# EAGLE design drive_subsystem (EAGLE 6.4)
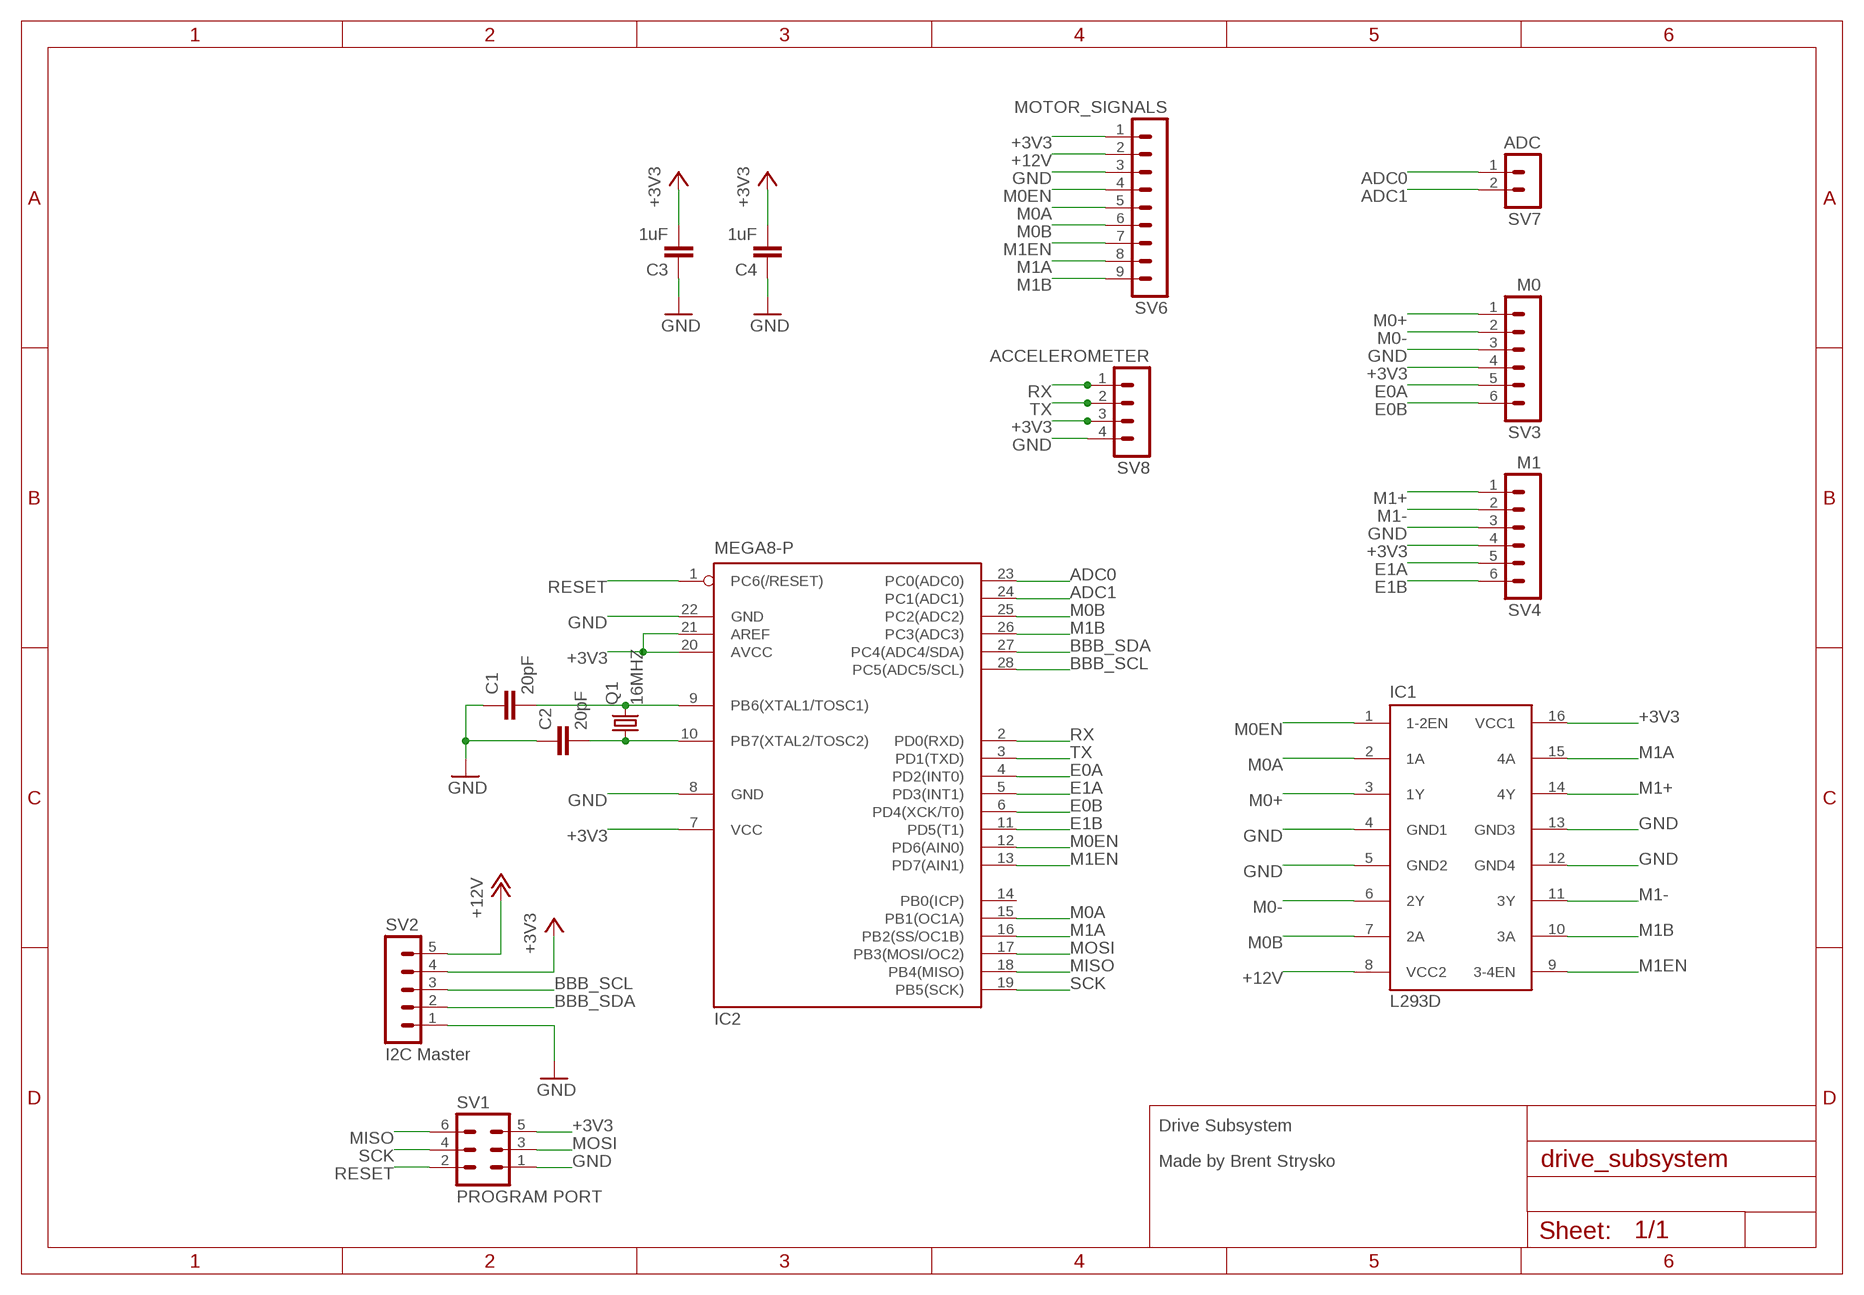
[diagram p0: schematic, sheet 1]

## Parts
C1  20pF  CAPKIT  [CAP-PTH-SMALL-KIT]
C2  20pF  CAPKIT  [CAP-PTH-SMALL-KIT]
C3  1uF  CAPKIT  [CAP-PTH-SMALL-KIT]
C4  1uF  CAPKIT  [CAP-PTH-SMALL-KIT]
IC1  L293D  [DIL16]
IC2  MEGA8-P  [DIL28-3]
Q1  16MHZ  CRYSTALHC49U-V  [HC49U-V]
SV1  PROGRAM PORT  MA03-2  [MA03-2]
SV2  I2C Master  MA05-1  [MA05-1]
SV3  M0  MA06-1  [MA06-1]
SV4  M1  MA06-1  [MA06-1]
SV6  MOTOR_SIGNALS  MA09-1  [MA09-1]
SV7  ADC  MA02-1  [MA02-1]
SV8  ACCELEROMETER  MA04-1  [MA04-1]

## Nets
+3V3: C3.2 C4.2 IC1.16(VCC1) IC2.7(VCC) IC2.20(AVCC) IC2.21(AREF) SV1.5 SV2.4 SV3.4 SV4.4 SV6.1 SV8.3
+12V: IC1.8(VCC2) SV2.5 SV6.2
ADC0: IC2.23(PC0(ADC0)) SV7.1
ADC1: IC2.24(PC1(ADC1)) SV7.2
BBB_SCL: IC2.28(PC5(ADC5/SCL)) SV2.3
BBB_SDA: IC2.27(PC4(ADC4/SDA)) SV2.2
E0A: IC2.4(PD2(INT0)) SV3.5
E0B: IC2.6(PD4(XCK/T0)) SV3.6
E1A: IC2.5(PD3(INT1)) SV4.5
E1B: IC2.11(PD5(T1)) SV4.6
GND: C1.1 C2.1 C3.1 C4.1 IC1.4(GND1) IC1.5(GND2) IC1.12(GND4) IC1.13(GND3) IC2.8(GND) IC2.22(GND) SV1.1 SV2.1 SV3.3 SV4.3 SV6.3 SV8.4
M0+: IC1.3(1Y) SV3.1
M0-: IC1.6(2Y) SV3.2
M0A: IC1.2(1A) IC2.15(PB1(OC1A)) SV6.5
M0B: IC1.7(2A) IC2.25(PC2(ADC2)) SV6.6
M0EN: IC1.1(1-2EN) IC2.12(PD6(AIN0)) SV6.4
M1+: IC1.14(4Y) SV4.1
M1-: IC1.11(3Y) SV4.2
M1A: IC1.15(4A) IC2.16(PB2(SS/OC1B)) SV6.8
M1B: IC1.10(3A) IC2.26(PC3(ADC3)) SV6.9
M1EN: IC1.9(3-4EN) IC2.13(PD7(AIN1)) SV6.7
MISO: IC2.18(PB4(MISO)) SV1.6
MOSI: IC2.17(PB3(MOSI/OC2)) SV1.3
RESET: IC2.1(PC6(/RESET)) SV1.2
RX: IC2.2(PD0(RXD)) SV8.1
SCK: IC2.19(PB5(SCK)) SV1.4
TX: IC2.3(PD1(TXD)) SV8.2
XTAL1: C1.2 IC2.9(PB6(XTAL1/TOSC1)) Q1.2
XTAL2: C2.2 IC2.10(PB7(XTAL2/TOSC2)) Q1.1
Unconnected: IC2.14(PB0(ICP))

## Notes on the sheet
- Drive Subsystem
- Made by Brent Strysko

## Library data of the parts
C1-C4 = SparkFun-Capacitors:CAP: Capacitor Standard 0603 ceramic capacitor, and 0.1" leaded capacitor.
IC1 = st-microelectronics:L293D: PUSH-PULL 4 CHANNEL DRIVER; MPN: L293D; OC_FARNELL: 9589619; OC_NEWARK: 56P8249
IC2 = atmel:MEGA8-P: MICROCONTROLLER 8 Kbytes FLASH, 1 kbytes SRAM, 512 bytes EEPROM, USART, 4-channel 10 bit ADC, 2-channel 8 bit ADC Pin compatible with Atmega48, ATMega88, ATMega168 Source: avr.lbr; OC_FARNELL: unknown; OC_NEWARK: unknown
Q1 = crystal:CRYSTAL: CRYSTAL; OC_FARNELL: 1666969; OC_NEWARK: unknown
SV1 = con-lstb:MA03-2: PIN HEADER; OC_FARNELL: unknown; OC_NEWARK: unknown
SV2 = con-lstb:MA05-1: PIN HEADER; OC_FARNELL: unknown; OC_NEWARK: unknown
SV3 SV4 = con-lstb:MA06-1: PIN HEADER; OC_FARNELL: unknown; OC_NEWARK: unknown
SV6 = con-lstb:MA09-1: PIN HEADER; OC_FARNELL: unknown; OC_NEWARK: unknown
SV7 = hypertriangle:MA02-1: PIN HEADER
SV8 = con-lstb:MA04-1: PIN HEADER; OC_FARNELL: unknown; OC_NEWARK: unknown

## Board
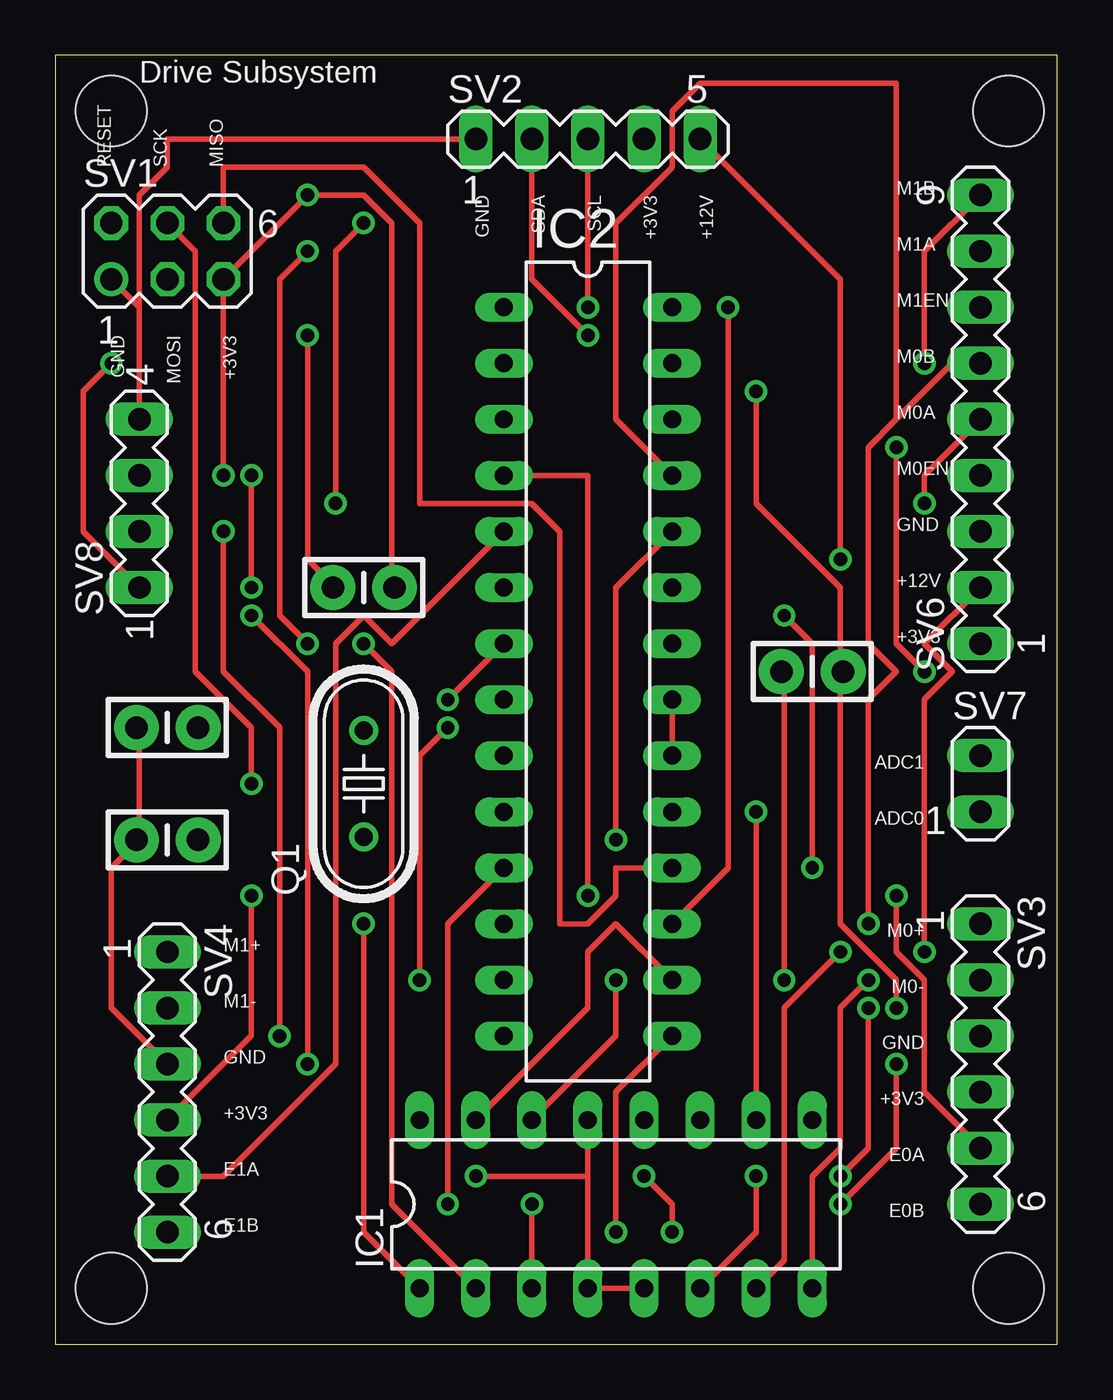
[diagram p1: board, top side]
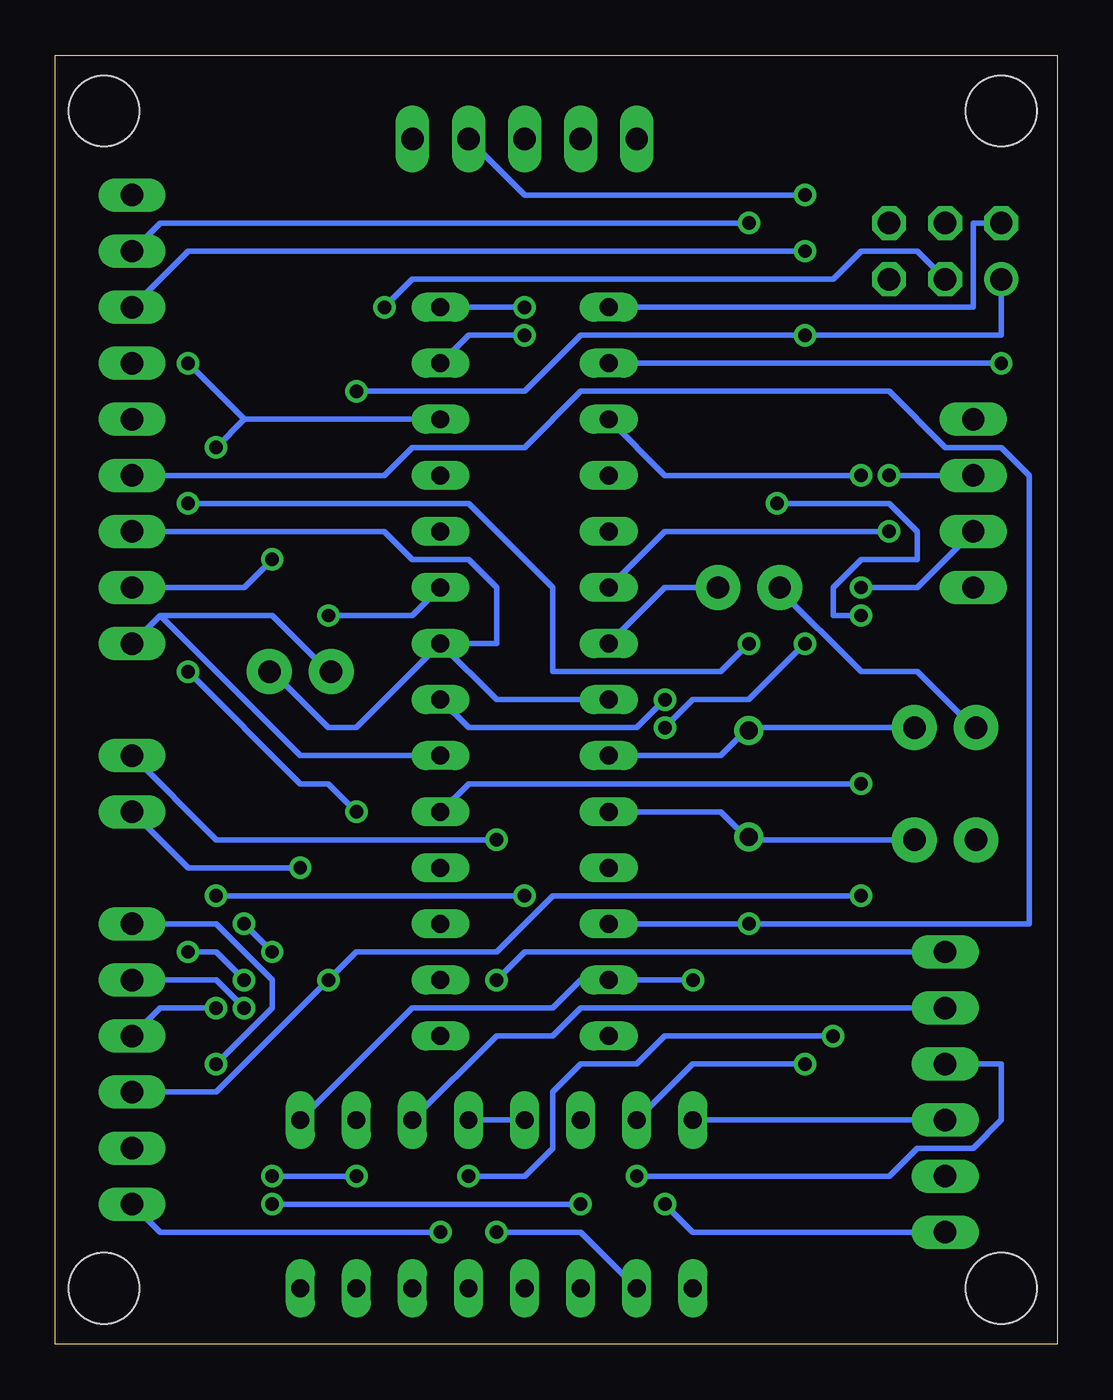
[diagram p2: board, bottom side, seen from below]

Size 45.39 x 58.41 mm. Coordinates in mm from the lower left corner, seen from the top.
Outline: 0,0 45.39,0 45.39,58.41 0,58.41 0,0
Copper layers (1*16): Top 0.035mm / dielectric 1.5mm / Bottom 0.035mm
Design rules "default": minimum track width 10mil, minimum drill 24mil, track to track 8mil, track to pad 8mil, pad to pad 8mil, via to via 8mil, smd to smd 8mil, copper to edge 40mil, drill to drill 8mil, minimum pad ring 10mil, minimum via ring 8mil, stop-mask expansion 4mil, vias tented up to drill 0mil, thermal gap 10mil
Holes 3.2 mm at 2.54,2.54 43.18,2.54 2.54,55.88 43.18,55.88

### Footprints (pad centres in the part's own frame; a part is rotated, then mirrored left to right if it is on the bottom)
CAP-PTH-SMALL-KIT = drill 1.016 pad 2.032: 1 -1.397,0; 2 1.397,0
DIL16 = drill 0.813 long: 1 -8.89,-3.81; 2 -6.35,-3.81; 3 -3.81,-3.81; 4 -1.27,-3.81; 5 1.27,-3.81; 6 3.81,-3.81; 7 6.35,-3.81; 8 8.89,-3.81; 9 8.89,3.81; 10 6.35,3.81; 11 3.81,3.81; 12 1.27,3.81; 13 -1.27,3.81; 14 -3.81,3.81; 15 -6.35,3.81; 16 -8.89,3.81
DIL28-3 = drill 0.813 long: 1 -16.51,-3.81; 2 -13.97,-3.81; 3 -11.43,-3.81; 4 -8.89,-3.81; 5 -6.35,-3.81; 6 -3.81,-3.81; 7 -1.27,-3.81; 8 1.27,-3.81; 9 3.81,-3.81; 10 6.35,-3.81; 11 8.89,-3.81; 12 11.43,-3.81; 13 13.97,-3.81; 14 16.51,-3.81; 15 16.51,3.81; 16 13.97,3.81; 17 11.43,3.81; 18 8.89,3.81; 19 6.35,3.81; 20 3.81,3.81; 21 1.27,3.81; 22 -1.27,3.81; 23 -3.81,3.81; 24 -6.35,3.81; 25 -8.89,3.81; 26 -11.43,3.81; 27 -13.97,3.81; 28 -16.51,3.81
HC49U-V = drill 0.813: 1 -2.413,0; 2 2.413,0
MA03-2 = drill 1.016: 1 -2.54,-1.27 | drill 1.016 octagon: 2 -2.54,1.27; 3 0,-1.27; 4 0,1.27; 5 2.54,-1.27; 6 2.54,1.27
MA05-1 = drill 1.016 long: 1 -5.08,0; 2 -2.54,0; 3 0,0; 4 2.54,0; 5 5.08,0
MA06-1 = drill 1.016 long: 1 -6.35,0; 2 -3.81,0; 3 -1.27,0; 4 1.27,0; 5 3.81,0; 6 6.35,0
MA09-1 = drill 1.016 long: 1 -10.16,0; 2 -7.62,0; 3 -5.08,0; 4 -2.54,0; 5 0,0; 6 2.54,0; 7 5.08,0; 8 7.62,0; 9 10.16,0
MA02-1 = drill 1.016 long: 1 0,-1.27; 2 0,1.27
MA04-1 = drill 1.016 long: 1 -3.81,0; 2 -1.27,0; 3 1.27,0; 4 3.81,0

### Placement (x,y rotation side)
C1  5.08,27.94 0 top
C2  5.08,22.86 0 top
C3  13.97,34.29 0 top
C4  34.29,30.48 180 top
IC1  25.4,6.35 0 top
IC2  24.13,30.48 270 top
Q1  13.97,25.4 90 top
SV1  5.08,49.53 0 top
SV2  24.13,54.61 0 top
SV3  41.91,12.7 270 top
SV4  5.08,11.43 270 top
SV6  41.91,41.91 90 top
SV7  41.91,25.4 0 top
SV8  3.81,38.1 90 top

### Tracks (layer width: path | path; a pad name or v marks a point on that pad's centre or on a via)
+3V3  (via drill 0.61)
  Top 0.254: v7.62,39.37 SV1.5 v11.43,52.07 13.97,52.07 15.24,50.8 15.24,34.29 C3.2 | IC2.21 IC2.20 | v33.02,16.51 33.02,30.48 C4.2 | SV4.4 8.89,13.97 v8.89,20.32 | v17.78,29.21 IC2.7
  Bottom 0.254: IC2.7 17.78,34.29 C3.2 15.24,34.29 | v7.62,39.37 SV8.3 | SV2.4 24.13,52.07 v11.43,52.07 | SV4.4 IC1.16 | SV3.4 38.1,11.43 v33.02,16.51 31.75,17.78 25.4,17.78 22.86,20.32 v8.89,20.32 | 40.64,33.02 SV6.1 | 40.64,33.02 35.56,33.02 33.02,30.48 C4.2 | IC2.20 34.29,26.67 40.64,33.02 | v17.78,29.21 19.05,27.94 26.67,27.94 IC2.21
+12V  (via drill 0.61)
  Top 0.254: IC1.8 34.29,7.62 35.56,8.89 35.56,15.24 v36.83,16.51 | v39.37,17.78 39.37,29.21 40.64,30.48 39.37,31.75 SV6.2 | SV2.5 35.56,48.26 v35.56,35.56
  Bottom 0.254: v36.83,16.51 38.1,17.78 v39.37,17.78 | v35.56,35.56 36.83,34.29 SV6.2
ADC0  (via drill 0.61)
  Top 0.254: v33.02,33.02 34.29,31.75 v34.29,21.59
  Bottom 0.254: IC2.23 29.21,33.02 v33.02,33.02 | v34.29,21.59 39.37,21.59 SV7.1
ADC1  (via drill 0.61)
  Top 0.254: IC2.24 25.4,34.29 v25.4,22.86
  Bottom 0.254: v25.4,22.86 38.1,22.86 SV7.2
BBB_SCL  (via drill 0.61)
  Top 0.254: SV2.3 v24.13,46.99
  Bottom 0.254: v24.13,46.99 IC2.28
BBB_SDA  (via drill 0.61)
  Top 0.254: v24.13,45.72 21.59,48.26 SV2.2
  Bottom 0.254: IC2.27 26.67,45.72 v24.13,45.72
E0A  (via drill 0.61)
  Top 0.254: IC2.4 24.13,39.37 v24.13,20.32 | v38.1,20.32 38.1,17.78 39.37,16.51 39.37,11.43 SV3.5
  Bottom 0.254: v38.1,20.32 v24.13,20.32
E0B  (via drill 0.61)
  Top 0.254: v7.62,36.83 7.62,30.48 10.16,27.94 v10.16,13.97 | v26.67,7.62 27.94,6.35 v27.94,5.08
  Bottom 0.254: IC2.6 17.78,36.83 v7.62,36.83 | v10.16,13.97 17.78,13.97 19.05,12.7 21.59,12.7 22.86,11.43 22.86,8.89 24.13,7.62 v26.67,7.62 | v27.94,5.08 40.64,5.08 SV3.6
E1A
  Top 0.254: IC2.5 15.24,31.75 13.97,33.02 12.7,31.75 12.7,12.7 7.62,7.62 SV4.5
E1B  (via drill 0.61)
  Top 0.254: IC2.11 17.78,19.05 v17.78,6.35
  Bottom 0.254: v17.78,6.35 16.51,5.08 SV4.6
GND  (via drill 0.61)
  Top 0.254: v38.1,15.24 38.1,16.51 35.56,19.05 35.56,30.48 | 3.81,46.99 SV1.1 | SV8.4 3.81,46.99 | SV2.1 5.08,54.61 5.08,53.34 3.81,52.07 3.81,46.99 | IC1.5 IC1.4 24.13,7.62 | IC1.13 24.13,7.62 | SV4.3 2.54,15.24 2.54,21.59 3.81,22.86 | 3.81,22.86 3.81,27.94 C1.1 | 3.81,22.86 C2.1 | v19.05,7.62 24.13,7.62 | v11.43,45.72 11.43,35.56 12.7,34.29 C3.1 | 35.56,30.48 35.56,34.29 31.75,38.1 v31.75,43.18 | 35.56,30.48 C4.1
  Bottom 0.254: SV3.3 40.64,15.24 v38.1,15.24 | IC2.8 25.4,29.21 IC2.22 | SV6.3 30.48,36.83 29.21,35.56 26.67,35.56 25.4,34.29 25.4,31.75 IC2.22 | IC2.22 31.75,27.94 33.02,27.94 35.56,30.48 C4.1 | IC1.12 IC1.13 | C3.1 12.7,34.29 8.89,30.48 6.35,30.48 3.81,27.94 C1.1 | v19.05,7.62 7.62,7.62 6.35,8.89 3.81,8.89 2.54,10.16 2.54,12.7 SV4.3 | SV1.1 2.54,45.72 v11.43,45.72 21.59,45.72 24.13,43.18 v31.75,43.18
M0+  (via drill 0.61)
  Top 0.254: v21.59,6.35 IC1.3 | v35.56,6.35 38.1,8.89 v38.1,12.7
  Bottom 0.254: v35.56,6.35 v21.59,6.35 | v38.1,12.7 35.56,15.24 35.56,16.51 38.1,19.05 SV3.1
M0-  (via drill 0.61)
  Top 0.254: IC1.6 31.75,5.08 v31.75,7.62 | v35.56,7.62 36.83,8.89 v36.83,15.24
  Bottom 0.254: v35.56,7.62 v31.75,7.62 | v36.83,15.24 38.1,16.51 SV3.2
M0A  (via drill 0.61)
  Top 0.254: v25.4,5.08 25.4,11.43 IC2.15 | SV6.5 39.37,39.37 v39.37,38.1 | v13.97,31.75 15.24,30.48 15.24,6.35 IC1.2
  Bottom 0.254: IC1.2 21.59,5.08 v25.4,5.08 | v39.37,38.1 26.67,38.1 22.86,34.29 22.86,30.48 15.24,30.48 v13.97,31.75
M0B  (via drill 0.61)
  Top 0.254: IC1.7 33.02,3.81 33.02,15.24 v35.56,17.78 | v36.83,19.05 36.83,29.21 38.1,30.48 36.83,31.75 36.83,40.64 38.1,41.91 | 38.1,41.91 40.64,44.45 SV6.6 | IC2.25 25.4,41.91 25.4,50.8 27.94,53.34 27.94,55.88 29.21,57.15 38.1,57.15 38.1,41.91
  Bottom 0.254: v36.83,19.05 v35.56,17.78
M0EN  (via drill 0.61)
  Top 0.254: IC1.1 13.97,5.08 v13.97,19.05
  Bottom 0.254: IC2.12 v13.97,19.05 1.27,19.05 1.27,39.37 2.54,40.64 5.08,40.64 7.62,43.18 21.59,43.18 24.13,40.64 29.21,40.64 30.48,39.37 SV6.4
M1+  (via drill 0.61)
  Top 0.254: IC1.14 25.4,13.97 v25.4,16.51
  Bottom 0.254: v25.4,16.51 24.13,17.78 SV4.1
M1-
  Bottom 0.254: IC1.11 25.4,13.97 22.86,13.97 21.59,15.24 SV4.2
M1A  (via drill 0.61)
  Top 0.254: IC1.15 24.13,15.24 24.13,17.78 25.4,19.05 IC2.16 | v13.97,50.8 12.7,49.53 v12.7,38.1 | v8.89,33.02 11.43,30.48 v11.43,12.7
  Bottom 0.254: SV6.8 40.64,50.8 v13.97,50.8 | v12.7,38.1 7.62,38.1 6.35,36.83 6.35,35.56 8.89,35.56 10.16,34.29 10.16,33.02 v8.89,33.02 | v11.43,12.7 16.51,12.7 IC1.15
M1B  (via drill 0.61)
  Top 0.254: v31.75,24.13 IC1.10 | v39.37,30.48 38.1,31.75 v38.1,40.64 | SV6.9 39.37,49.53 v39.37,44.45
  Bottom 0.254: v31.75,24.13 33.02,25.4 34.29,25.4 v39.37,30.48 | 36.83,41.91 v38.1,40.64 | IC2.26 36.83,41.91 | 36.83,41.91 v39.37,44.45
M1EN  (via drill 0.61)
  Top 0.254: v11.43,49.53 10.16,48.26 10.16,33.02 v11.43,31.75 | v17.78,27.94 16.51,26.67 v16.51,16.51
  Bottom 0.254: IC1.9 29.21,15.24 22.86,15.24 21.59,16.51 IC2.13 v16.51,16.51 | SV6.7 39.37,49.53 v11.43,49.53 | v11.43,31.75 13.97,29.21 16.51,29.21 v17.78,27.94
MISO
  Top 0.254: IC2.18 25.4,21.59 25.4,20.32 24.13,19.05 22.86,19.05 22.86,36.83 21.59,38.1 16.51,38.1 16.51,50.8 13.97,53.34 7.62,53.34 SV1.6
MOSI  (via drill 0.61)
  Top 0.254: IC2.17 30.48,21.59 v30.48,46.99
  Bottom 0.254: v30.48,46.99 29.21,48.26 10.16,48.26 8.89,49.53 6.35,49.53 SV1.3
RESET
  Bottom 0.254: IC2.1 3.81,46.99 3.81,50.8 SV1.2
RX  (via drill 0.61)
  Top 0.254: v2.54,44.45 1.27,43.18 1.27,36.83 SV8.1
  Bottom 0.254: v2.54,44.45 IC2.2
SCK  (via drill 0.61)
  Top 0.254: v8.89,25.4 8.89,27.94 6.35,30.48 6.35,49.53 SV1.4
  Bottom 0.254: IC2.19 26.67,25.4 v8.89,25.4
TX  (via drill 0.61)
  Top 0.254: v8.89,34.29 v8.89,39.37
  Bottom 0.254: IC2.3 17.78,39.37 v8.89,39.37 | v8.89,34.29 6.35,34.29 SV8.2
XTAL1
  Bottom 0.254: IC2.9 15.24,26.67 13.97,27.94 | 13.97,27.94 C1.2 6.35,27.94 | 13.97,27.94 Q1.2
XTAL2
  Bottom 0.254: 13.97,22.86 15.24,24.13 IC2.10 | 13.97,22.86 C2.2 6.35,22.86 | 13.97,22.86 Q1.1

### Text on the board
tPlace: Drive Subsystem | RESET | SCK | MISO | GND | SDA | SCL | +3V3 | +12V | M1B | M1A | M1EN | GND | MOSI | +3V3 | M0B | M0A | M0EN | GND | +12V | +3V3 | ADC1 | ADC0 | M0+ | M1+ | M0- | M1- | GND | GND | +3V3 | +3V3 | E0A | E1A | E0B | E1B